# Altium schematic sheet ETH-PHY.SchDoc
size A3
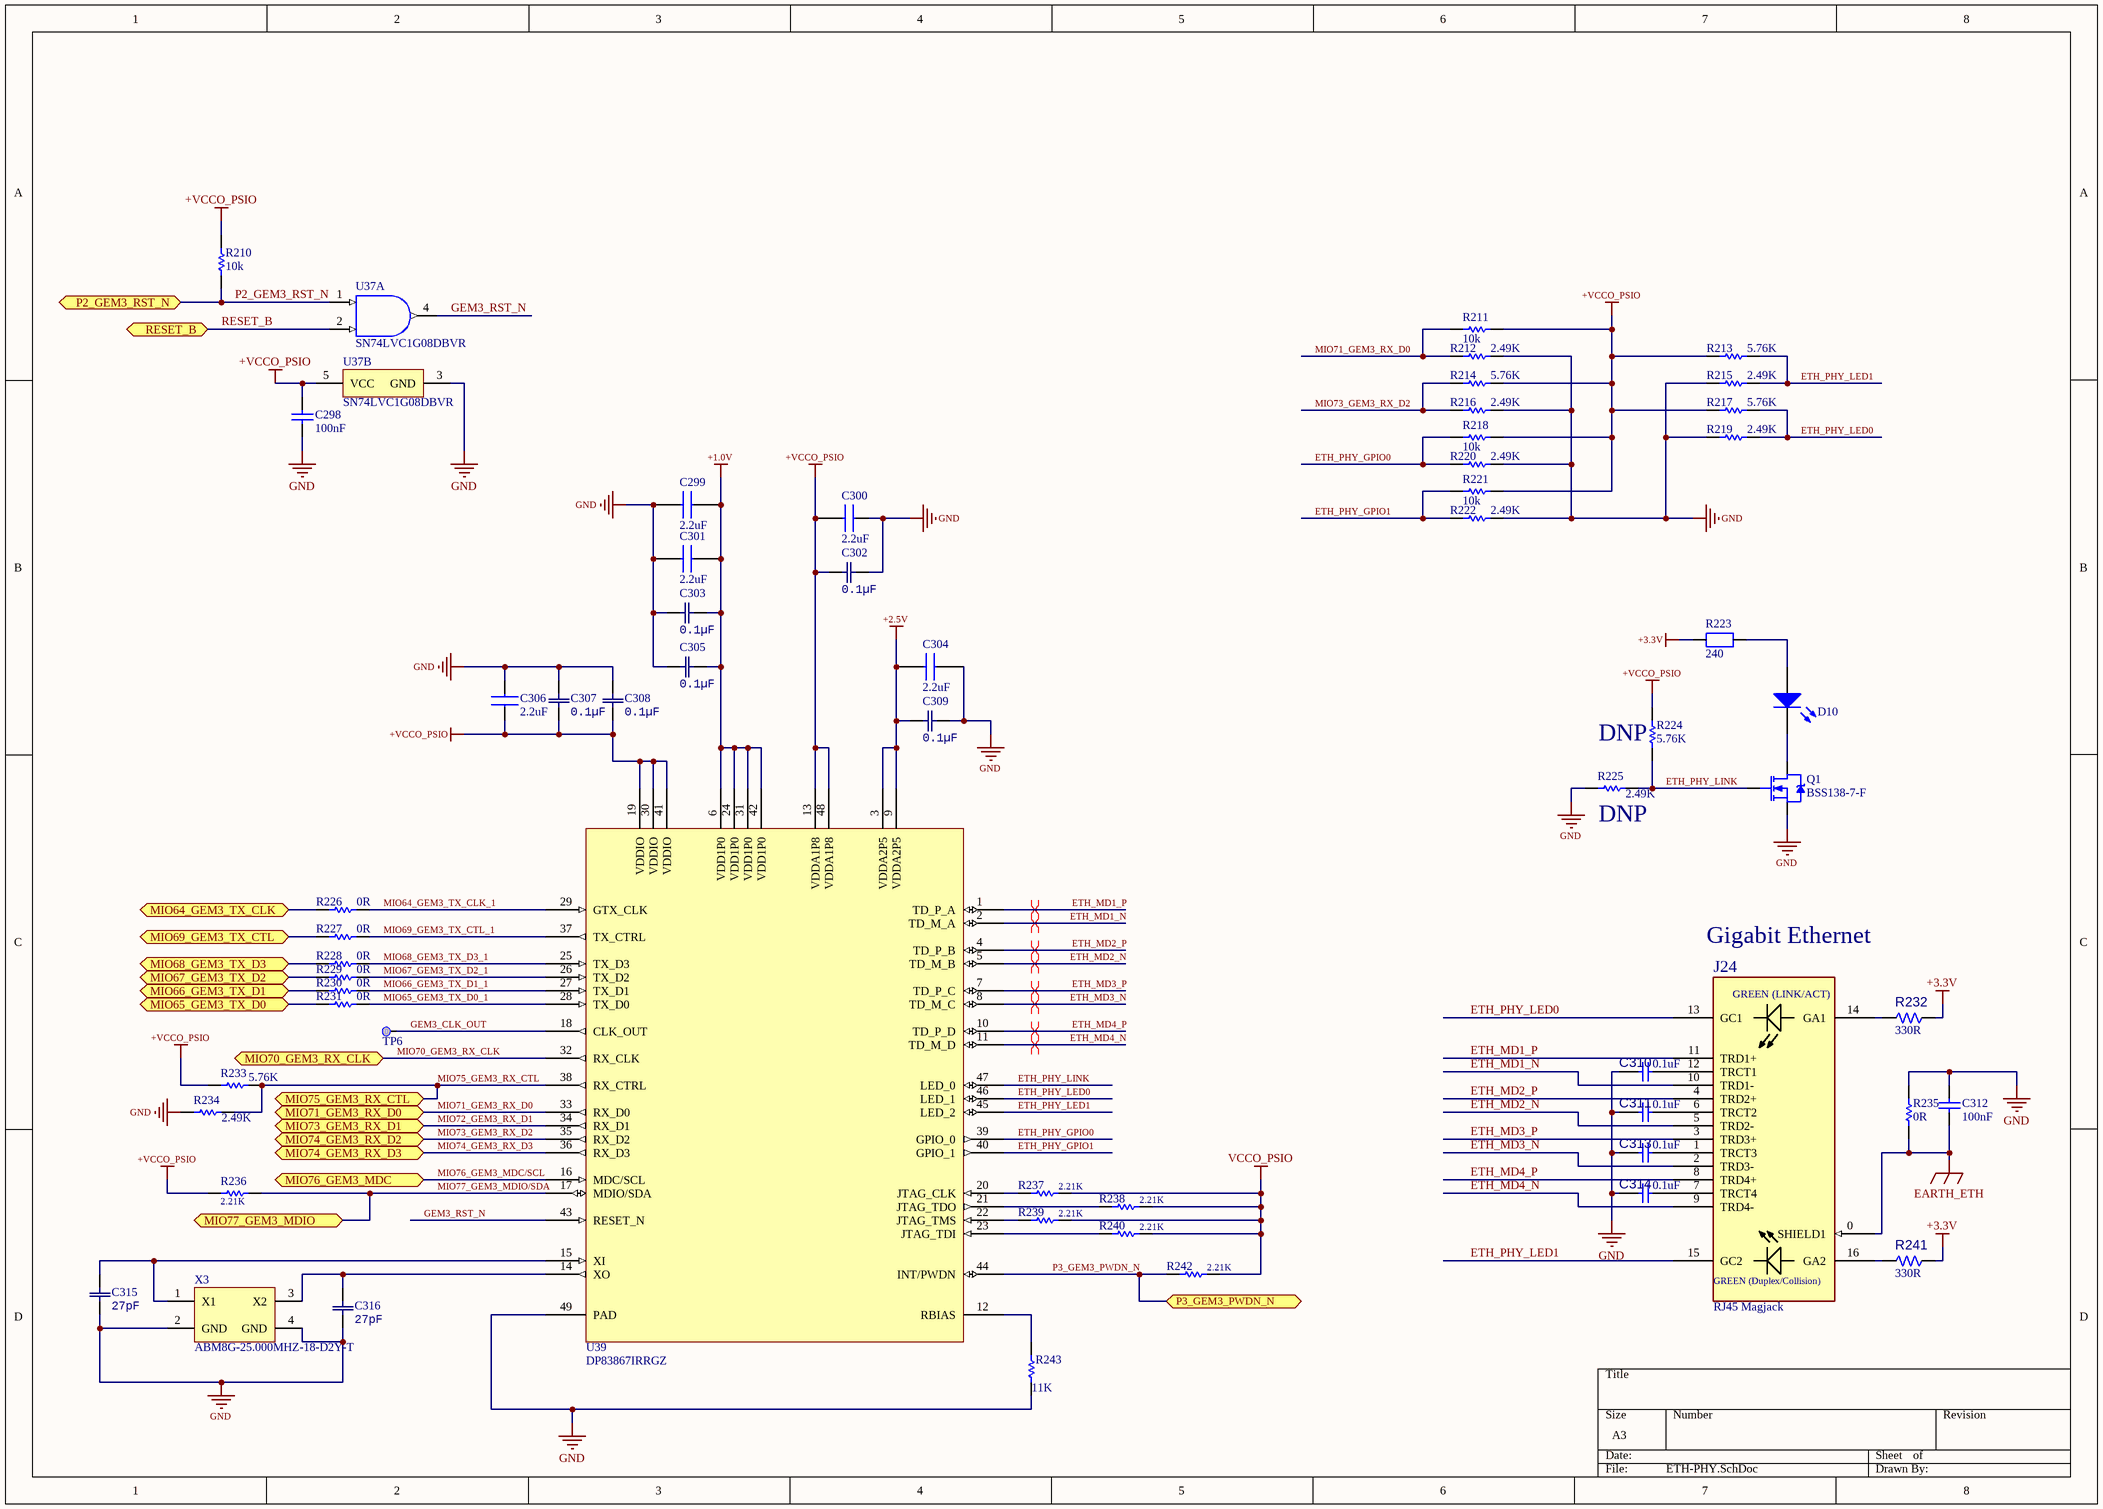
[diagram p0: ETH-PHY.SchDoc]

## Parts
C298  100nF  [CAPC1005L_0402]
C299  value 2.2uF  [CAPC0603X33N]  (hidden comment: GRM033R61A225KE47D)
C300  value 2.2uF  [CAPC0603X33N]  (hidden comment: GRM033R61A225KE47D)
C301  value 2.2uF  [CAPC0603X33N]  (hidden comment: GRM033R61A225KE47D)
C302  value 0.1µF  [CAP_0603]  (hidden comment: C0603X5R1E104K030BB)
C303  value 0.1µF  [CAP_0603]  (hidden comment: C0603X5R1E104K030BB)
C304  value 2.2uF  [CAPC0603X33N]  (hidden comment: GRM033R61A225KE47D)
C305  value 0.1µF  [CAP_0603]  (hidden comment: C0603X5R1E104K030BB)
C306  value 2.2uF  [CAPC0603X33N]  (hidden comment: GRM033R61A225KE47D)
C307  value 0.1µF  [CAP_0603]  (hidden comment: C0603X5R1E104K030BB)
C308  value 0.1µF  [CAP_0603]  (hidden comment: C0603X5R1E104K030BB)
C309  value 0.1µF  [CAP_0603]  (hidden comment: C0603X5R1E104K030BB)
C310  value 0.1uF  [CAP_C_0402]  (hidden comment: Capacitor NP)
C311  value 0.1uF  [CAP_C_0402]  (hidden comment: Capacitor NP)
C312  100nF  [CAPC1005L_0402]
C313  value 0.1uF  [CAP_C_0402]  (hidden comment: Capacitor NP)
C314  value 0.1uF  [CAP_C_0402]  (hidden comment: Capacitor NP)
C315  value 27pF  [CAP_0603]  (hidden comment: C0603X5R1E104K030BB)
C316  value 27pF  [CAP_0603]  (hidden comment: C0603X5R1E104K030BB)
D10  (no value)  [LED0603BLUE]
J24  RJ45 Magjack  [CON_MODULAR_RJ45_TH_RA_RJMG2012211A0FR]
Q1  BSS138-7-F  [DIODES_SOT23]
R210  value 10k  [RESC1005L_0402]  (hidden comment: RES0402_10K_0W1_05T)
R211  value 10k  [RESC1005L_0402]  (hidden comment: RES0402_10K_0W1_05T)
R212  value 2.49K  [RC0201N]  (hidden comment: CRCW02012K49FKED)
R213  Resistance_(Ohms): 5.76K  [RC0201N]  (hidden comment: ERJ-1GEF5761C)
R214  Resistance_(Ohms): 5.76K  [RC0201N]  (hidden comment: ERJ-1GEF5761C)
R215  value 2.49K  [RC0201N]  (hidden comment: CRCW02012K49FKED)
R216  value 2.49K  [RC0201N]  (hidden comment: CRCW02012K49FKED)
R217  Resistance_(Ohms): 5.76K  [RC0201N]  (hidden comment: ERJ-1GEF5761C)
R218  value 10k  [RESC1005L_0402]  (hidden comment: RES0402_10K_0W1_05T)
R219  value 2.49K  [RC0201N]  (hidden comment: CRCW02012K49FKED)
R220  value 2.49K  [RC0201N]  (hidden comment: CRCW02012K49FKED)
R221  value 10k  [RESC1005L_0402]  (hidden comment: RES0402_10K_0W1_05T)
R222  value 2.49K  [RC0201N]  (hidden comment: CRCW02012K49FKED)
R223  value 240  [RESC0603X28N]  (hidden comment: CRCW0201240RFNED)
R224  Resistance_(Ohms): 5.76K  [RC0201N]  (hidden comment: ERJ-1GEF5761C)
R225  value 2.49K  [RC0201N]  (hidden comment: CRCW02012K49FKED)
R226  value 0R  [RESC1005L_0402]  (hidden comment: RES0402_0R)
R227  value 0R  [RESC1005L_0402]  (hidden comment: RES0402_0R)
R228  value 0R  [RESC1005L_0402]  (hidden comment: RES0402_0R)
R229  value 0R  [RESC1005L_0402]  (hidden comment: RES0402_0R)
R230  value 0R  [RESC1005L_0402]  (hidden comment: RES0402_0R)
R231  value 0R  [RESC1005L_0402]  (hidden comment: RES0402_0R)
R232  value 330R  [RES_C_0603]  (hidden comment: Resistor)
R233  Resistance_(Ohms): 5.76K  [RC0201N]  (hidden comment: ERJ-1GEF5761C)
R234  value 2.49K  [RC0201N]  (hidden comment: CRCW02012K49FKED)
R235  value 0R  [RESC1005L_0402]  (hidden comment: RES0402_0R_0W1)
R236  value 2.21K  [RC0201N]  (hidden comment: ERJ-1GEF2211C)
R237  value 2.21K  [RC0201N]  (hidden comment: ERJ-1GEF2211C)
R238  value 2.21K  [RC0201N]  (hidden comment: ERJ-1GEF2211C)
R239  value 2.21K  [RC0201N]  (hidden comment: ERJ-1GEF2211C)
R240  value 2.21K  [RC0201N]  (hidden comment: ERJ-1GEF2211C)
R241  value 330R  [RES_C_0603]  (hidden comment: Resistor)
R242  value 2.21K  [RC0201N]  (hidden comment: ERJ-1GEF2211C)
R243  value 11K  [RES_V0201]  (hidden comment: CRCW020111K0FKED)
TP6  TP  [TP]  (value not drawn)  (no BOM)
U37  SN74LVC1G08DBVR  [DBV0005A_N]  (parts A,B of 2)
U39  DP83867IRRGZ  [QFN50P700X700X100_HS-49N]
X3  ABM8G-25.000MHZ-18-D2Y-T  [ABM8G]

## Ports
MIO64_GEM3_TX_CLK, MIO65_GEM3_TX_D0, MIO66_GEM3_TX_D1, MIO67_GEM3_TX_D2, MIO68_GEM3_TX_D3, MIO69_GEM3_TX_CTL, MIO70_GEM3_RX_CLK, MIO71_GEM3_RX_D0, MIO73_GEM3_RX_D1, MIO74_GEM3_RX_D2, MIO74_GEM3_RX_D3, MIO75_GEM3_RX_CTL, MIO76_GEM3_MDC, MIO77_GEM3_MDIO, P2_GEM3_RST_N, P3_GEM3_PWDN_N, RESET_B

## Nets
+1.0V: C299.1 C301.1 C303.2 C305.1 U39.6(VDD1P0) U39.24(VDD1P0) U39.31(VDD1P0) U39.42(VDD1P0)
+2.5V: C304.2 C309.1 U39.3(VDDA2P5) U39.9(VDDA2P5)
+3.3V: R223.1 R232.2 R241.2
+VCCO_PSIO: C298.1 C300.2 C302.1 C306.1 C307.1 C308.1 R210.2 R211.2 R213.1 R214.2 R217.1 R218.2 R221.2 R224.2 R233.1 R236.1 U37.5(VCC) U39.13(VDDA1P8) U39.19(VDDIO) U39.30(VDDIO) U39.41(VDDIO) U39.48(VDDA1P8)
EARTH_ETH: C312.2 J24.0(SHIELD1) R235.1
GND: C298.2 C299.2 C300.1 C301.2 C302.2 C303.1 C304.1 C305.2 C306.2 C307.2 C308.2 C309.2 C310.2 C311.2 C312.1 C313.2 C314.2 C315.1 C316.1 Q1.S R212.2 R215.1 R216.2 R219.1 R220.2 R222.2 R225.1 R234.1 R235.2 R243.1 U37.3(GND) U39.49(PAD) X3.2(GND) X3.4(GND)
VCCO_PSIO: R237.2 R238.2 R239.2 R240.2 R242.2
ETH_MD1_N: J24.10(TRD1-) U39.2(TD_M_A)
ETH_MD1_P: J24.11(TRD1+) U39.1(TD_P_A)
ETH_MD2_N: J24.5(TRD2-) U39.5(TD_M_B)
ETH_MD2_P: J24.4(TRD2+) U39.4(TD_P_B)
ETH_MD3_N: J24.2(TRD3-) U39.8(TD_M_C)
ETH_MD3_P: J24.3(TRD3+) U39.7(TD_P_C)
ETH_MD4_N: J24.9(TRD4-) U39.11(TD_M_D)
ETH_MD4_P: J24.8(TRD4+) U39.10(TD_P_D)
ETH_PHY_GPIO0: R218.1 R220.1 U39.39(GPIO_0)
ETH_PHY_GPIO1: R221.1 R222.1 U39.40(GPIO_1)
ETH_PHY_LED0: J24.13(GC1) R217.2 R219.2 U39.46(LED_1)
ETH_PHY_LED1: J24.15(GC2) R213.2 R215.2 U39.45(LED_2)
ETH_PHY_LINK: Q1.G R224.1 R225.2 U39.47(LED_0)
GEM3_CLK_OUT: TP6.1 U39.18(CLK_OUT)
GEM3_RST_N: U37.4(Y) U39.43(RESET_N)
MIO64_GEM3_TX_CLK: R226.1 ; port MIO64_GEM3_TX_CLK
MIO64_GEM3_TX_CLK_1: R226.2 U39.29(GTX_CLK)
MIO65_GEM3_TX_D0: R231.1 ; port MIO65_GEM3_TX_D0
MIO65_GEM3_TX_D0_1: R231.2 U39.28(TX_D0)
MIO66_GEM3_TX_D1: R230.1 ; port MIO66_GEM3_TX_D1
MIO66_GEM3_TX_D1_1: R230.2 U39.27(TX_D1)
MIO67_GEM3_TX_D2: R229.1 ; port MIO67_GEM3_TX_D2
MIO67_GEM3_TX_D2_1: R229.2 U39.26(TX_D2)
MIO68_GEM3_TX_D3: R228.1 ; port MIO68_GEM3_TX_D3
MIO68_GEM3_TX_D3_1: R228.2 U39.25(TX_D3)
MIO69_GEM3_TX_CTL: R227.1 ; port MIO69_GEM3_TX_CTL
MIO69_GEM3_TX_CTL_1: R227.2 U39.37(TX_CTRL)
MIO70_GEM3_RX_CLK: U39.32(RX_CLK) ; port MIO70_GEM3_RX_CLK
MIO71_GEM3_RX_D0: R211.1 R212.1 U39.33(RX_D0) ; port MIO71_GEM3_RX_D0
MIO72_GEM3_RX_D1: U39.34(RX_D1) ; port MIO73_GEM3_RX_D1
MIO73_GEM3_RX_D2: R214.1 R216.1 U39.35(RX_D2) ; port MIO74_GEM3_RX_D2
MIO74_GEM3_RX_D3: U39.36(RX_D3) ; port MIO74_GEM3_RX_D3
MIO75_GEM3_RX_CTL: R233.2 R234.2 U39.38(RX_CTRL) ; port MIO75_GEM3_RX_CTL
MIO76_GEM3_MDC/SCL: U39.16(MDC/SCL) ; port MIO76_GEM3_MDC
MIO77_GEM3_MDIO/SDA: R236.2 U39.17(MDIO/SDA) ; port MIO77_GEM3_MDIO
P2_GEM3_RST_N: R210.1 U37.1(A) ; port P2_GEM3_RST_N
P3_GEM3_PWDN_N: R242.1 U39.44(INT/PWDN) ; port P3_GEM3_PWDN_N
RESET_B: U37.2(B) ; port RESET_B
NetC310_1: C310.1 J24.12(TRCT1)
NetC311_1: C311.1 J24.6(TRCT2)
NetC313_1: C313.1 J24.1(TRCT3)
NetC314_1: C314.1 J24.7(TRCT4)
NetC315_2: C315.2 U39.15(XI) X3.1(X1)
NetC316_2: C316.2 U39.14(XO) X3.3(X2)
NetD10_1: D10.1(A) R223.2
NetD10_2: D10.2(K) Q1.D
NetJ24_14: J24.14(GA1) R232.1
NetJ24_16: J24.16(GA2) R241.1
NetR237_1: R237.1 U39.20(JTAG_CLK)
NetR238_1: R238.1 U39.21(JTAG_TDO)
NetR239_1: R239.1 U39.22(JTAG_TMS)
NetR240_1: R240.1 U39.23(JTAG_TDI)
NetR243_2: R243.2 U39.12(RBIAS)

## Layout directives
differential pair: ETH_MD1_N, ETH_MD1_P, ETH_MD2_N, ETH_MD2_P, ETH_MD3_N, ETH_MD3_P, ETH_MD4_N, ETH_MD4_P

## Notes on the sheet
- (near R224) DNP
- (near R225) DNP
- Gigabit Ethernet
- (in symbol CON RJ-45 RJMG2012211A0FR) GREEN (LINK/ACT); GREEN (Duplex/Collision)

## Library data of the parts
C298 C312 = CAPCER0402X7R100N25V_10T: CAP CER 0.1UF 25V X7R 0402; Manufacturer 1: Murata Electronics North America; Manufacturer Part Number 1: GRM155R71E104KE14D; Tolerance: 10%; Package: 0402; ComponentLink1Description: Datasheet; Value: 100nF; Voltage: 25V; Temperature Coefficient: X7R; Supplier 1: Digi-Key; Supplier Part Number 1: 490-10698-1-ND; Operating Temperature: -55°C ~ 125°C
C299-C301 C304 C306 = GRM033R61A225KE47D: Multilayer Ceramic Capacitors MLCC - SMD/SMT 0201 2.2uF 10volts *Derate Voltage/Temp; Manufacturer_Name: Murata Electronics; Geometry.Height: 0.33mm; Supplier_Name: RS; RS Part Number: *; Manufacturer_Part_Number: GRM033R61A225KE47D; Other Part Number: *; Datasheet Link: http://www.murata.com/~/media/webrenewal/support/library/catalog/products/capacitor/mlcc/c02e.pdf; Supplier 1: Digi-Key; Supplier Part Number 1: 490-13227-1-ND
C302 C303 C305 C307-C309 C315 C316 = C0603X5R1E104K030BB: CAP CER 0.1UF 25V 10% X5R 0201; Manufacturer: TDK Corporation; Detailed Description: 0.1µF ±10% 25V Ceramic Capacitor X5R 0201 (0603 Metric); Manufacturer_Part_Number: C0603X5R1E104K030BB; Digi-Key Part Number: 445-13671-1-ND; Tolerance: ±10%; Voltage - Rated: 25V; Temperature Coefficient: X5R; Operating Temperature: -55°C ~ 85°C; Features: Low ESL; Applications: General Purpose; Mounting Type: Surface Mount, MLCC; Supplier 1: Digi-Key; Supplier Part Number 1: 445-13671-1-ND
C310 C311 C313 C314 = CAP1463: Capacitor; Manufacturer 1: TDK Corporation; Manufacturer Part Number 1: C1005X7R1H104K050BB; Voltage: 50V; Description_: CAP CER 0.1uF 50V 10% X7R SMD 0402; Dev Tools Status: Design; Tolerance: 10%; Temperature Coeffcient: X7R; Type: Ceramic; Owner: Jamus Griego; Populated: YES; MCHP-ID: CAP1463; Package: 0402; Revision: A; Status: MCL Design; ComponentLink1URL: https://chn-vm-apps.microchip.com/mchprepo/parts/Datasheets/TDKMLCCCapRange.pdf; ComponentLink1Description: Datasheets; Operating Temperature: -55C to +125C; Category: Capacitor; Supplier 1: Digi-Key; Supplier Part Number 1: 445-5932-1-ND; Quantity Override: 1
D10 = LED0603BLUE: LED BLUE DIFFUSED 0603 SMD; Manufacturer 1: Broadcom Limited; Manufacturer Part Number 1: HSMR-C191; Voltage - Forward (Vf) (Typ): 3.4V; Current - Test: 20mA; Package: 0603; Supplier 1: Digi-Key; Supplier Part Number 1: 516-2523-1-ND; ComponentLink1Description: Datasheet; ComponentLink1URL: C:\Users\Public\Documents\Altium\AD16\Library\PDF\AV02-0592EN0.pdf
J24 = CON RJ-45 RJMG2012211A0FR: Manufacturer 1: Amphenol Commercial Products; Populated: Yes; Description_: CON MODULAR RJ45 MAGJACK TH R/A; Manufacturer Part Number 1: RJMG2012211A0FR; RoHS: RoHS Compliant; ComponentLink1URL: https://www.amphenolcanada.com/ProductSearch/Drawings/AC/RJMG2012211A0FR.PDF; ComponentLink1Description: Datasheet; Supplier 1: Digikey; Supplier Part Number 1: RJMG2012211A0FR-ND; Value: RJ45 Magjack
Q1 = BSS138-7-F: MOSFET N-CH 50V 200MA SOT23-3; Manufacturer 1: Diodes Incorporated; ComponentLink1Description: Datasheet; ComponentLink1URL: C:\Users\Public\Documents\Altium\AD16\Library\PDF\ds30144.pdf; Supplier 1: Digi-Key; Supplier Part Number 1: BSS138-FDICT-ND; Manufacturer Part Number 1: BSS138-7-F; Operating Temperature: -55°C ~ 150°C (TJ)
R210 R211 R218 R221 = RES0402_10K_0W1_05T: RES SMD 10K OHM 0.5% 1/16W 0402; Manufacturer 1: Panasonic Electronic Components; Manufacturer Part Number 1: ERJ-2RHD1002X; Package: 0402; ComponentLink1Description: Datasheet; Power: 1/16W; Tolerance: 0.5%; Supplier 1: Digi-Key; Supplier Part Number 1: P15984CT-ND
R212 R215 R216 R219 R220 R222 R225 R234 = CRCW02012K49FKED: RES 2.49K OHM 0201 1% 1/20W; Vendor: Vishay; Resistance_In_Ohms: 22.0; Power_(Watts): 0.05W, 1/20W; Tolerance: Â±1%; Lead_Style: Surface Mount (SMD - SMT); Voltage_-_Working: 30V; Temperature_Coefficient: Â±200ppm/Â°C; C: Copyright (C) 2015 Accelerated Designs. All rights reserved; Digi-Key Part Number: 541-2.49KAABCT-ND; Manufacturer_Part_Number: CRCW02012K49FKED; Quantity_Available: 0; Copyright: Copyright (C) 2015 Accelerated Designs. All rights reserved; DataSheet: http://www.vishay.com/doc?20035; Case: 0201 (0603 metric); Packaging: Tape &amp; Reel (TR); Composition: Thick Film; Supplier 1: Digi-Key; Supplier Part Number 1: 541-2.49KAABCT-ND
R213 R214 R217 R224 R233 = ERJ-1GEF5761C: RES 5.76K OHM 0201 1% 1/20W; Vendor: Panasonic; Power_(Watts): 0.05W, 1/20W; Tolerance: Â±1%; Lead_Style: Surface Mount (SMD - SMT); Voltage_-_Working: 15V; Temperature_Coefficient: Â±200ppm/Â°C; Number_of_Terminations: 2; C: Copyright (C) 2015 Accelerated Designs. All rights reserved; DigiKeyPartNumber: P4.70KABTR-ND; Manufacturer_Part_Number: ERJ-1GEF5761C; Quantity_Available: 0; Copyright: Copyright (C) 2015 Accelerated Designs. All rights reserved; DataSheet: http://industrial.panasonic.com/www-data/pdf/AOA0000/AOA0000CE2.pdf; Resistance_In_Ohms: 5.76K; Case: 0201 (0603 metric); Packaging: Tape &amp; Reel (TR); Composition: Thick Film; Features: -; Package_/_Case: 0201 (0603 Metric); Size_/_Dimension: 0.024" L x 0.012" W (0.60mm x 0.30mm); Height: 0.010" (0.26mm); Value: Value; Supplier 1: Digi-Key; Supplier Part Number 1: P5.76KABCT-ND
R223 = CRCW0201240RFNED: VISHAY - CRCW0201240RFNED - RES, THICK FILM, 240R, 1%, 0.05W, 0201; Geometry.Height: 0.28mm; Supplier_Name: RS; RS Part Number: *; Manufacturer_Name: Vishay; Manufacturer_Part_Number: CRCW0201240RFNED; Allied_Number: *; Other Part Number: *; Datasheet Link: http://www.vishay.com/docs/20035/dcrcwe3.pdf; 3D Package: *; Supplier 1: Digi-Key; Supplier Part Number 1: 541-2949-1-ND
R226-R231 = RES0402_0R: RES SMD 0 OHM JUMPER 1/16W 0402; Manufacturer 1: Vishay Dale; Manufacturer Part Number 1: CRCW04020000Z0ED; Power: 0.063W, 1/16W; Package: 0402; ComponentLink1Description: Datasheet; Tolerance: -; Supplier 1: Digi-Key; Supplier Part Number 1: 541-0.0JCT-ND
R232 R241 = RSMT0166: Manufacturer 1: Panasonic; Manufacturer Part Number 1: ERJ-3GEYJ331V; Tolerance: 5%; Description_: RES TKF 330R 5% 1/10W SMD 0603; Dev Tools Status: Production; Voltage: 75V; Temperature Coeffcient: 200ppm/C; Power: 1/10W; Populated: Yes; MCHP-ID: RSMT0166; Package: 0603; Revision: 1; Status: MCL Design; ComponentLink1URL: https://chn-vm-apps.microchip.com/mchprepo/parts/Datasheets/AOA0000CE1.pdf; ComponentLink1Description: Datasheet; Operating Temperature: -55C to +155C; Category: Resistor; Type: RES SMD; Composition: TKF; Manufacturer 2: KOA Speer; Manufacturer Part Number 2: RK73B1JTTD331J; Manufacturer 3: Stackpole Electronics Inc; Manufacturer Part Number 3: RMCF 1/16 330 5% R; Supplier 1: Digi-Key; Supplier Part Number 1: P330GTR-ND; Supplier 2: KOA Speer; Supplier Part Number 2: RK73B1JTTD331J; Supplier 3: Stackpole Electronics Inc; Supplier Part Number 3: RMCF 1/16 330 5% R; Quantity Override: 1
R235 = RES0402_0R_0W1: RES SMD 0 OHM JUMPER 1/10W 0402; Manufacturer 1: Panasonic Electronic Components; Manufacturer Part Number 1: ERJ-2GE0R00X; Package: 0402; ComponentLink1Description: Datasheet; Power: 1/10W; Tolerance: -; Supplier 1: Digi-Key; Supplier Part Number 1: P0.0JCT-ND
R236-R240 R242 = ERJ-1GEF2211C: RES 2.21K OHM 0201 1% 1/20W; Vendor: Panasonic; Resistance_In_Ohms: 0.0; Power_(Watts): 0.05W, 1/20W; Tolerance: Jumper; Lead_Style: Surface Mount (SMD - SMT); Voltage_-_Working: 15V; Number_of_Terminations: 2; C: Copyright (C) 2015 Accelerated Designs. All rights reserved; DigiKeyPartNumber: P0.0AGTR-ND; Manufacturer_Part_Number: ERJ-1GEF2211C; Quantity_Available: 1650000; Copyright: Copyright (C) 2015 Accelerated Designs. All rights reserved; DataSheet: http://industrial.panasonic.com/www-data/pdf/AOA0000/AOA0000CE2.pdf; Case: 0201 (0603 metric); Packaging: Tape &amp; Reel (TR); Composition: Thick Film; Temperature_Coefficient: -; Resistance_(Ohms): 0.0; Features: -; Package_/_Case: 0201 (0603 Metric); Size_/_Dimension: 0.024" L x 0.012" W (0.60mm x 0.30mm); Height: 0.010" (0.26mm)
R243 = CRCW020111K0FKED: RES 11.0K OHM 0201 1% 1/20W; Vendor: Vishay; C: Copyright (C) 2015 Accelerated Designs. All rights reserved; Manufacturer_Part_Number: CRCW020111K0FKED; Copyright: Copyright (C) 2015 Accelerated Designs. All rights reserved; Supplier 1: Digi-Key; Supplier Part Number 1: 541-11.0KAABCT-ND
TP6 = Test Point
U37 = SN74LVC1G08DBVR: Single 2-Input Positive-AND Gate, DBV0005A, LARGE T&R; Manufacturer 1: Texas Instruments; VCC(Min)(V): 1.65; VCC(Max)(V): 5.5; Output Type: CMOS; ICC @ Nom Voltage(Max)(mA): 0.01; Input Type: CMOS/TTL; Bits(#): 1; F @ Nom Voltage(Max)(Mhz): 150; Rating: Catalog; Technology Family: LVC; Voltage(Nom)(V): 1.8,2.5,3.3,5; Schmitt Trigger: No; Output Drive (IOL/IOH)(Max)(mA): 32/-32; tpd @ Nom Voltage(Max)(ns): 4.5,6,4,5; Logic: True; Gate Type: AND; DatasheetVersion: SCES217Y; PackageReference: DBV0005A; Supplier 2: Mouser; Supplier Part Number 2: 595-SN74LVC1G08DBVR; Supplier 1: Digi-Key; Supplier Part Number 1: 296-11601-2-ND; Supplier 3: Digi-Key; Supplier Part Number 3: 296-11601-1-ND; Supplier 4: Digi-Key; Supplier Part Number 4: 296-11601-6-ND; Generic Part Number: SN74LVC1G08; Operating Temperature: -40°C ~ 125°C; Sub-Family: AND Gate; 3-State Output: No; Manufacturer Part Number 1: SN74LVC1G08DBVR; ComponentLink1Description: Manufacturer URL; ComponentLink1URL: C:\Users\Public\Documents\Altium\AD16\Library\PDF\sn74lvc1g08.pdf
U39 = DP83867IRRGZ: IC ETHERNET PHY 48VQFN; Manufacturer 1: Texas Instruments; Manufacturer Part Number 1: DP83867IRRGZT; ComponentLink1Description: Datasheet; ComponentLink1URL: C:\Users\Public\Documents\Altium\AD16\Library\PDF\dp83867ir.pdf; Supplier 1: Digi-Key; Supplier Part Number 1: 296-47204-1-ND; Operating Temperature: -40°C ~ 85°C
X3 = ABM8G-25.000MHZ-18-D2Y-T: CRYSTAL 25.0000MHZ 18PF SMD; Manufacturer 1: Abracon LLC; Frequency: 25MHz; Frequency Stability: ±30ppm; ComponentLink1Description: Datasheet; ComponentLink1URL: C:\Users\Public\Documents\Altium\AD16\Library\PDF\ABM8G.pdf; Supplier 1: Digi-Key; Supplier Part Number 1: 535-10275-1-ND; Manufacturer Part Number 1: ABM8G-25.000MHZ-18-D2Y-T; Operating Temperature: -40°C ~ 85°C; Load Capacitance: 18pF